# Altium project MB1355C.PrjPcb
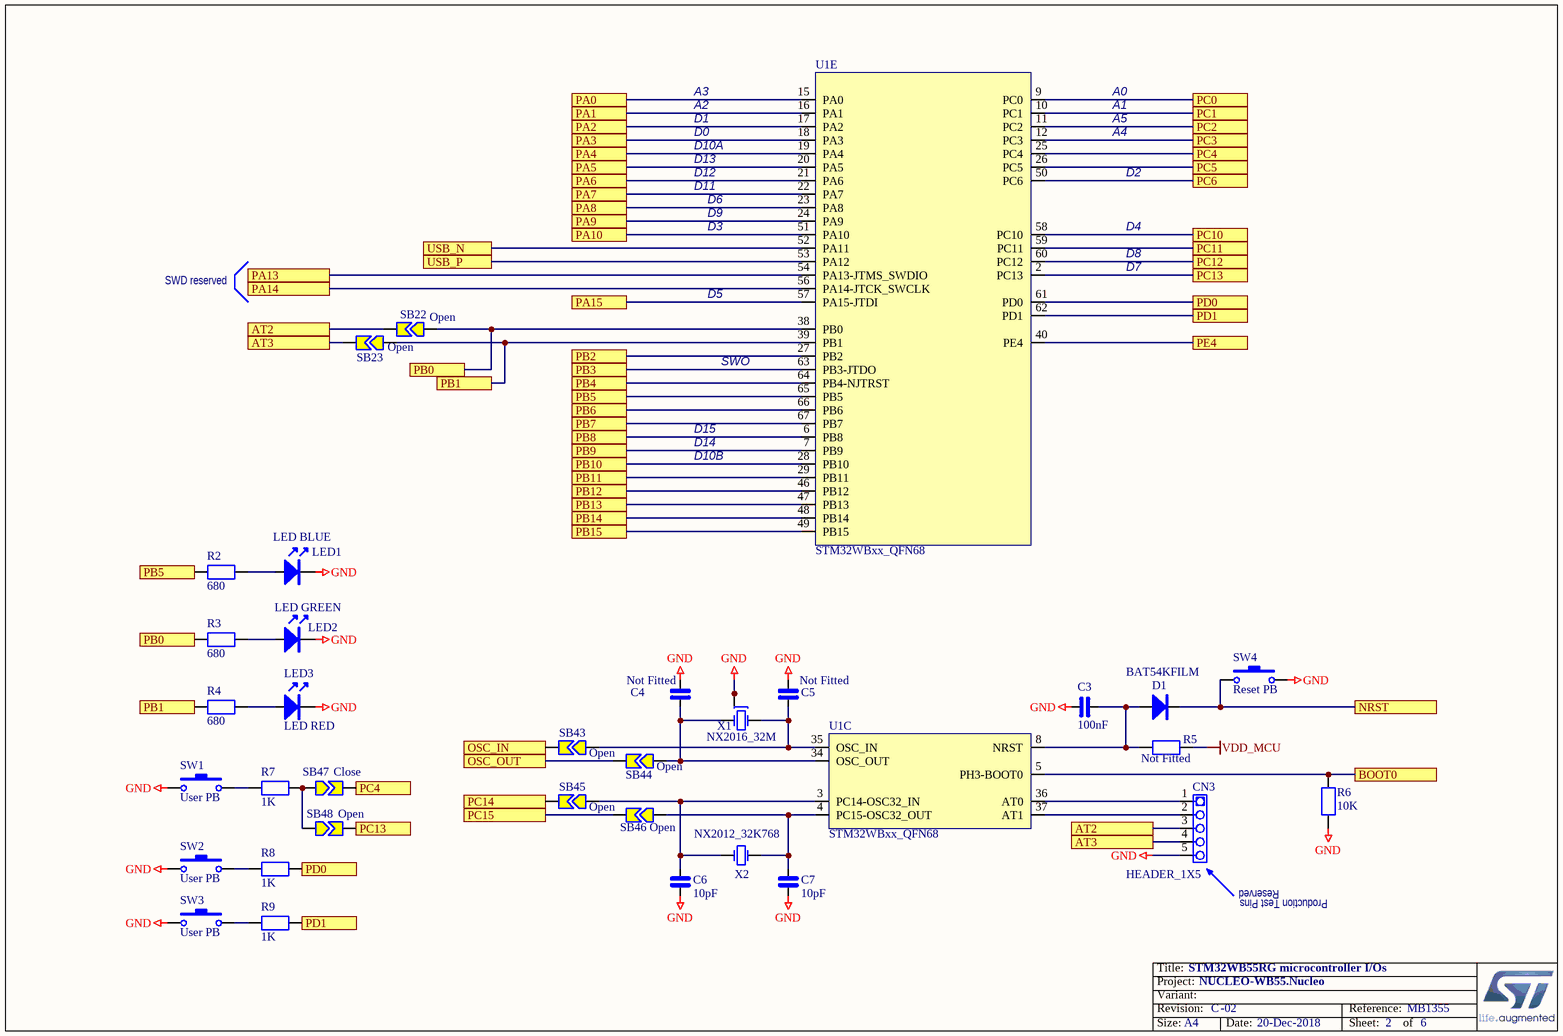
[diagram p0: MCU.SchDoc]
Board_Assembly_Revision: 02; Board_Document_Date: 20-Dec-2018; Board_Name: NUCLEO-WB55.Nucleo; Board_PCB_Revision: C; Board_Reference: MB1355
3 sheets, 148 parts. Net scope: flat (ports and power ports of the same name join across sheets).
Board file: Nucleo_Dory_QFN68.PcbDoc
Sheets:
  MCU.SchDoc
  Power_managment.SchDoc
  ST_LINK_V2-1.SCHDOC

## Sheet MCU.SchDoc: STM32WB55RG microcontroller I/Os
size A4; Author: Ph.A; SheetNumber: 2; SheetTotal: 6

### Parts
C3  100nF  [0402_CAP_NPOL]
C4  Fitted: Not Fitted  [0402_CAP_NPOL]  (hidden comment: TBD)
C5  Fitted: Not Fitted  [0402_CAP_NPOL]  (hidden comment: TBD)
C6  10pF  [0402_CAP_NPOL]
C7  10pF  [0402_CAP_NPOL]
CN3  HEADER_1X5  [Header NF 1x5x2.54 TH]
D1  BAT54KFILM  [SOD523]
LED1  LED BLUE  [0603_LED_Blue]
LED2  LED GREEN  [0603_LED_GREEN]
LED3  LED RED  [0603_LED_RED]
R2  680  [0402_RES]
R3  680  [0402_RES]
R4  680  [0402_RES]
R5  Fitted: Not Fitted  [0402_RES]  (hidden comment: 100K (not fitted))
R6  10K  [0402_RES]
R7  1K  [0402_RES]
R8  1K  [0402_RES]
R9  1K  [0402_RES]
SB22  Open  [SB-tiny]
SB23  Open  [SB-tiny]
SB43  Open  [SB-tiny]
SB44  Open  [SB-tiny]
SB45  Open  [SB-tiny]
SB46  Open  [SB-tiny]
SB47  Close  [SB-tiny]
SB48  Open  [SB-tiny]
SW1  User PB  [SW-PB SMD KMR2]
SW2  User PB  [SW-PB SMD KMR2]
SW3  User PB  [SW-PB SMD KMR2]
SW4  Reset PB  [SW-PB SMD KMR2]
U1  STM32WBxx_QFN68  [VFQFPN68_8x8x0.1_p0.4]  (parts C,E of 5)
X1  NX2016_32M  [NX2016_4P]
X2  NX2012_32K768  [NX2012_2P]

### Ports
AT2, AT3, BOOT0, NRST, OSC_IN, OSC_OUT, PA0, PA1, PA2, PA3, PA4, PA5, PA6, PA7, PA8, PA9, PA10, PA13, PA14, PA15, PB0, PB1, PB2, PB3, PB4, PB5, PB6, PB7, PB8, PB9, PB10, PB11, PB12, PB13, PB14, PB15, PC0, PC1, PC2, PC3, PC4, PC5, PC6, PC10, PC11, PC12, PC13, PC14, PC15, PD0, PD1, PE4, USB_N, USB_P

### Nets
GND: C3.1 C4.2 C5.2 C6.2 C7.2 CN3.5 LED1.K LED2.K LED3.K R6.2 SW1.1 SW2.1 SW3.1 SW4.2 X1.2 X1.4
VDD_MCU: R5.1
AT2: CN3.3 SB22.2 ; port AT2
AT3: CN3.4 SB23.2 ; port AT3
BOOT0: R6.1 U1.5(PH3-BOOT0) ; port BOOT0
NRST: D1.K SW4.1 ; port NRST
OSC_IN: SB43.2 ; port OSC_IN
OSC_OUT: SB44.2 ; port OSC_OUT
PA0: U1.15(PA0) ; port PA0
PA1: U1.16(PA1) ; port PA1
PA2: U1.17(PA2) ; port PA2
PA3: U1.18(PA3) ; port PA3
PA4: U1.19(PA4) ; port PA4
PA5: U1.20(PA5) ; port PA5
PA6: U1.21(PA6) ; port PA6
PA7: U1.22(PA7) ; port PA7
PA8: U1.23(PA8) ; port PA8
PA9: U1.24(PA9) ; port PA9
PA10: U1.51(PA10) ; port PA10
PA13: U1.54(PA13-JTMS_SWDIO) ; port PA13
PA14: U1.56(PA14-JTCK_SWCLK) ; port PA14
PA15: U1.57(PA15-JTDI) ; port PA15
PB0: R3.1 SB22.1 U1.38(PB0) ; port PB0
PB1: R4.1 SB23.1 U1.39(PB1) ; port PB1
PB2: U1.27(PB2) ; port PB2
PB3: U1.63(PB3-JTDO) ; port PB3
PB4: U1.64(PB4-NJTRST) ; port PB4
PB5: R2.1 U1.65(PB5) ; port PB5
PB6: U1.66(PB6) ; port PB6
PB7: U1.67(PB7) ; port PB7
PB8: U1.6(PB8) ; port PB8
PB9: U1.7(PB9) ; port PB9
PB10: U1.28(PB10) ; port PB10
PB11: U1.29(PB11) ; port PB11
PB12: U1.46(PB12) ; port PB12
PB13: U1.47(PB13) ; port PB13
PB14: U1.48(PB14) ; port PB14
PB15: U1.49(PB15) ; port PB15
PC0: U1.9(PC0) ; port PC0
PC1: U1.10(PC1) ; port PC1
PC2: U1.11(PC2) ; port PC2
PC3: U1.12(PC3) ; port PC3
PC4: SB47.2 U1.25(PC4) ; port PC4
PC5: U1.26(PC5) ; port PC5
PC6: U1.50(PC6) ; port PC6
PC10: U1.58(PC10) ; port PC10
PC11: U1.59(PC11) ; port PC11
PC12: U1.60(PC12) ; port PC12
PC13: SB48.2 U1.2(PC13) ; port PC13
PC14: SB45.2 ; port PC14
PC15: SB46.2 ; port PC15
PD0: R8.2 U1.61(PD0) ; port PD0
PD1: R9.2 U1.62(PD1) ; port PD1
PE4: U1.40(PE4) ; port PE4
USB_N: U1.52(PA11) ; port USB_N
USB_P: U1.53(PA12) ; port USB_P
NetC3_2: C3.2 D1.A R5.2 U1.8(NRST)
NetC4_1: C4.1 SB44.1 U1.34(OSC_OUT) X1.3(OSC2)
NetC5_1: C5.1 SB43.1 U1.35(OSC_IN) X1.1(OSC1)
NetC6_1: C6.1 SB45.1 U1.3(PC14-OSC32_IN) X2.1(OSC1)
NetC7_1: C7.1 SB46.1 U1.4(PC15-OSC32_OUT) X2.2(OSC2)
NetCN3_1: CN3.1 U1.36(AT0)
NetCN3_2: CN3.2 U1.37(AT1)
NetLED1_A: LED1.A R2.2
NetLED2_A: LED2.A R3.2
NetLED3_A: LED3.A R4.2
NetR7_1: R7.1 SW1.2
NetR7_2: R7.2 SB47.1 SB48.1
NetR8_1: R8.1 SW2.2
NetR9_1: R9.1 SW3.2

### Notes on the sheet
- A2
- A3
- A0
- A1
- D12
- D13
- D0
- D1
- D10A
- A4
- A5
- D2
- D11
- D9
- D3
- D6
- D4
- SWD reserved
- D5
- D7
- D8
- SWO
- D14
- D15
- D10B
- (near CN3) Reserved
- (near CN3) Production Test Pins
- Title:
- Project:
- Size:
- Revision:
- Variant:
- -
- Date:
- Reference:
- Sheet:
- of

### Library data of the parts
C3-C7 = CAP_NPOL: Capacitor_not polarized
D1 = BAT54K: Schottky Diode
LED1-LED3 = LED: Light-Emitting Diode; Part Number A: *
  LED1: Color: BLUE
R2-R9 = RES: Resistor
SB22 SB23 SB43-SB48 = Strap2: Solder Jumper; Solder: YES; Published: 24-Mar-1999; Revision: July-2002: Re-released for DXP Platform.; Publisher: Altium Limited
SW1-SW4 = SW-PB_1: Push-button SMD; Order code RS: 102-412
X1 = NX2016_32M: Crystal NDK 2.0x1.6mm  32 MHz; Manufacturer P/N: NX2016SA 32 MHz EXS00A-CS06654; Ref: NX2016SA 32MHz  EXS00A-CS06654  Référence interne NDK : X5087283; Manufacturer: NDK
X2 = NX2012_32K768: Crystal NDK 2.0x1.2mm  32.768 KHz; Manufacturer P/N: NX2012SA 32.768KHz  EXS00A-MU00389; Ref: NX2012SA 32.768KHz  EXS00A-MU00389  Référence interne NDK : X3037088; Manufacturer: NDK

## Sheet Power_managment.SchDoc: Power Management
size A4; Author: Ph.A; SheetNumber: 5; SheetTotal: 6
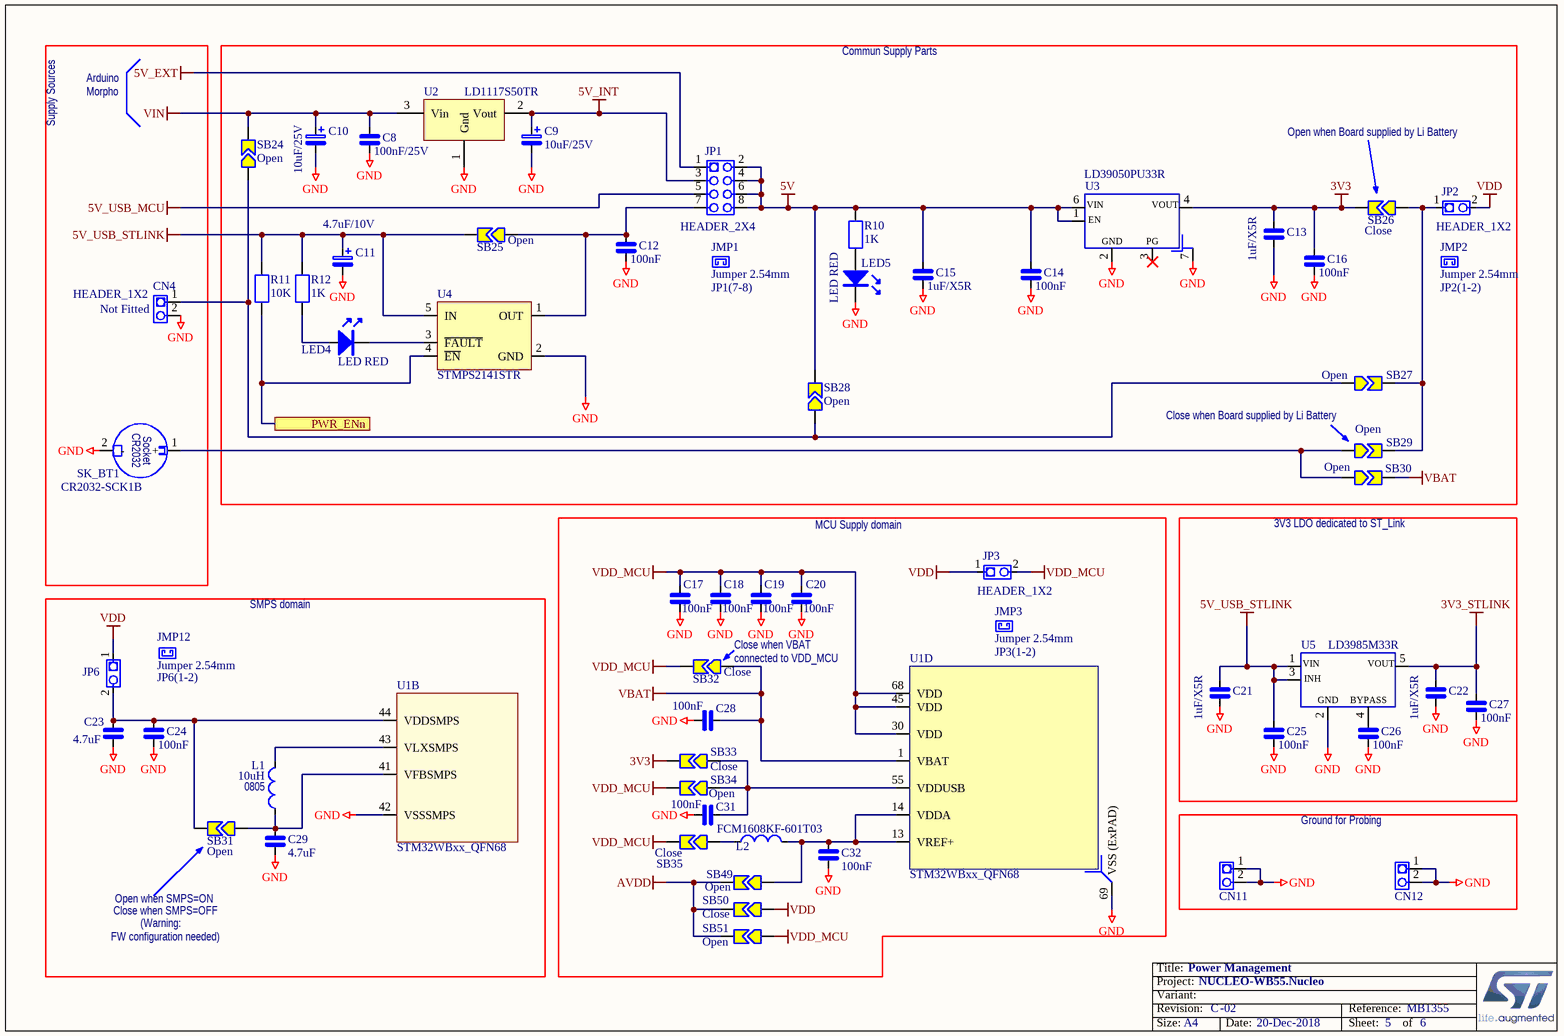
[diagram p1: Power_managment.SchDoc]

### Parts
C8  100nF/25V  [0402_CAP_NPOL]
C9  10uF/25V  [1210_CAP_POL]
C10  10uF/25V  [1210_CAP_POL]
C11  4.7uF/10V  [1210_CAP_POL]
C12  100nF  [0402_CAP_NPOL]
C13  1uF/X5R  [0603_CAP_NPOL]
C14  100nF  [0402_CAP_NPOL]
C15  1uF/X5R  [0603_CAP_NPOL]
C16  100nF  [0402_CAP_NPOL]
C17  100nF  [0402_CAP_NPOL]
C18  100nF  [0402_CAP_NPOL]
C19  100nF  [0402_CAP_NPOL]
C20  100nF  [0402_CAP_NPOL]
C21  1uF/X5R  [0603_CAP_NPOL]
C22  1uF/X5R  [0603_CAP_NPOL]
C23  4.7uF  [0402_CAP_NPOL]
C24  100nF  [0402_CAP_NPOL]
C25  100nF  [0402_CAP_NPOL]
C26  100nF  [0402_CAP_NPOL]
C27  100nF  [0402_CAP_NPOL]
C28  100nF  [0402_CAP_NPOL]
C29  4.7uF  [0402_CAP_NPOL]
C31  100nF  [0402_CAP_NPOL]
C32  100nF  [0402_CAP_NPOL]
CN4  HEADER_1X2  Fitted: Not Fitted  [Header NF 1x2x2.54 TH]
CN11  HEADER_1X2  [Header M 1x2x2.54 TH V]  (value not drawn)
CN12  HEADER_1X2  [Header M 1x2x2.54 TH V]  (value not drawn)
JMP1  Jumper 2.54mm  Default: JP1(7-8)  [Jumper 2.54mm BLACK]
JMP2  Jumper 2.54mm  Default: JP2(1-2)  [Jumper 2.54mm BLACK]
JMP3  Jumper 2.54mm  default: JP3(1-2)  [Jumper 2.54mm BLACK]
JMP12  Jumper 2.54mm  default: JP6(1-2)  [Jumper 2.54mm BLACK]
JP1  HEADER_2X4  [Header M 2x4x2.54 TH V]
JP2  HEADER_1X2  [Header M 1x2x2.54 TH V]
JP3  HEADER_1X2  [Header M 1x2x2.54 TH V]
JP6  HEADER_1X2  [Header M 1x2x2.54 TH V]  (value not drawn)
L1  10uH  [0805_COIL]
L2  FCM1608KF-601T03  [0603_COIL]
LED4  LED RED  [0603_LED_RED]
LED5  LED RED  [0603_LED_RED]
R10  1K  [0402_RES]
R11  10K  [0402_RES]
R12  1K  [0402_RES]
SB24  Open  [SB-tiny]
SB25  Open  [SB-tiny]
SB26  Close  [SB-tiny]
SB27  Open  [SB-tiny]
SB28  Open  [SB-tiny]
SB29  Open  [SB-tiny]
SB30  Open  [SB-tiny]
SB31  Open  [SB-tiny]
SB32  Close  [SB-tiny]
SB33  Close  [SB-tiny]
SB34  Open  [SB-tiny]
SB35  Close  [SB-tiny]
SB49  Open  [SB-tiny]
SB50  Close  [SB-tiny]
SB51  Open  [SB-tiny]
SK_BT1  CR2032-SCK1B  [CR2032-SCK1]
U1  STM32WBxx_QFN68  [VFQFPN68_8x8x0.1_p0.4]  (parts B,D of 5)
U2  LD1117S50TR  [SOT223_SC73_A]
U3  LD39050PU33R  [DFN6 3x3mm]
U4  STMPS2141STR  [SOT23-5]
U5  LD3985M33R  [SOT23-5]

### Blocks framed on the sheet
3V3 LDO dedicated to ST_Link: C21 C22 C25-C27 U5
Ground for Probing: CN11 CN12

### Ports
PWR_ENn

### Nets
3V3: C13.1 C16.1 SB26.2 SB33.2 U3.4(VOUT)
3V3_STLINK: C22.1 C27.1 U5.5(VOUT)
5V: C14.1 C15.1 JP1.2 JP1.4 JP1.6 JP1.8 R10.1 SB28.2 U3.1(EN) U3.6(VIN)
5V_EXT: JP1.1
5V_INT: C9.1 JP1.3 U2.2(Vout)
5V_USB_MCU: JP1.5
5V_USB_STLINK: C11.1 C21.1 C25.1 R11.1 R12.1 SB25.2 U4.5(IN) U5.1(VIN) U5.3(CE)
AVDD: SB49.2 SB50.2 SB51.2
GND: C8.2 C9.2 C10.2 C11.2 C12.2 C13.2 C14.2 C15.2 C16.2 C17.2 C18.2 C19.2 C20.2 C21.2 C22.2 C23.2 C24.2 C25.2 C26.2 C27.2 C28.2 C29.2 C31.2 C32.2 CN4.2 CN11.1 CN11.2 CN12.1 CN12.2 LED5.K SK_BT1.2(-) U1.42(VSSSMPS) U1.69(VSS_(ExPAD)) U2.1(Gnd) U3.2(VSS) U3.7 U4.2(GND) U5.2(VSS)
VBAT: C28.1 SB30.2 SB32.1 U1.1(VBAT)
VDD: JP2.2 JP3.1 JP6.1 SB50.1
VDD_MCU: C17.1 C18.1 C19.1 C20.1 JP3.2 SB32.2 SB34.2 SB35.2 SB51.1 U1.30(VDD) U1.45(VDD) U1.68(VDD)
VIN: C8.1 C10.1 SB24.2 U2.3(Vin)
PWR_ENn: R11.2 U4.4(~{EN}) ; port PWR_ENn
NetC12_1: C12.1 JP1.7 SB25.1 U4.1(OUT)
NetC23_1: C23.1 C24.1 JP6.2 SB31.2 U1.44(VDDSMPS)
NetC26_1: C26.1 U5.4(BYPASS)
NetC29_1: C29.1 L1.1 SB31.1 U1.41(VFBSMPS)
NetC31_1: C31.1 SB33.1 SB34.1 U1.55(VDDUSB)
NetC32_1: C32.1 L2.2 SB49.1 U1.13(VREF+) U1.14(VDDA)
NetCN4_1: CN4.1 SB24.1 SB27.1 SB28.1
NetJP2_1: JP2.1 SB26.1 SB27.2 SB29.2
NetL1_2: L1.2 U1.43(VLXSMPS)
NetL2_1: L2.1 SB35.1
NetLED4_A: LED4.A R12.2
NetLED4_K: LED4.K U4.3(~{FAULT})
NetLED5_A: LED5.A R10.2
NetSB29_1: SB29.1 SB30.1 SK_BT1.1(+)

Not connected (* = marked no-connect by the designer): U3 3(PG)*

### Notes on the sheet
- Arduino
- Morpho
- Commun Supply Parts
- Supply Sources
- Open when Board supplied by Li Battery
- Close when Board supplied by Li Battery
- MCU Supply domain
- SMPS domain
- (near SB32) Close when VBAT
- (near SB32) connected to VDD_MCU
- (near L1) 0805
- Close when SMPS=OFF
- Open when SMPS=ON
- FW configuration needed)
- (Warning:
- Title:
- Project:
- Size:
- Revision:
- Variant:
- A4
- -
- Date:
- Reference:
- Sheet:
- of
- (in symbol CR2032-SCK1B) CR2032; Socket
- (in symbol LD3985M33R) INH; GND
- (in symbol LD39050PU33R) GND

### Library data of the parts
C8 C12-C29 C31 C32 = CAP_NPOL: Capacitor_not polarized
C9-C11 = CAP_POL: Condensateur_polarise
JP2 JP3 JP6 = HEADER_1X2_L
L1 = IND_74479777310A: Coil Wurtz 10uH ref: 74479777310A
L2 = IND_FCM1608KF-601T03
LED4 LED5 = LED: Light-Emitting Diode; Part Number A: *
R10-R12 = RES: Resistor
SB24-SB35 SB49-SB51 = Strap2: Solder Jumper; Solder: YES; Published: 24-Mar-1999; Revision: July-2002: Re-released for DXP Platform.; Publisher: Altium Limited
U2 = LD1117S50TR: IC REG LDO 5V 0.8A SOT223; Manuf_1: STM; ECCN_US/EU: EAR99/NEC; Ref St: 9176133; Fitted: YES; Manuf_Part_1: LD1117S50TR; Distrib: STM; Ordered_By: STM; Order_code: LD1117S50TR; Value: LD1117S50TR
U3 = LD39050PU33R: 3.3V voltage regulator 500mA
U4 = STMPS2141STR: Enhanced single channel power switches; Manuf_1: STM; Provided: ST; ECCN_US/EU: EAR99/NEC; Ref St: 9159003; Order: STMPS2141STR; Manuf_Part_1: STMPS2141STR; Distrib: ST; Ordered by: ST
U5 = LD3985M33R: 3.3V low drop voltage regulator; Manufacturer: STMicroelectronics; Isortie max: 550mA; V entrée max: 6V; Manufacturer P/N: LD3985M33R; Order code Farnell: *; V sortie Typ. V: 3.3V; Temperature Max: +125°C; Type: Fixed; Temperature Min: -40°C

## Sheet ST_LINK_V2-1.SCHDOC: ST-Link/V2-1
size A4; Author: Ph.A; SheetNumber: 6; SheetTotal: 6
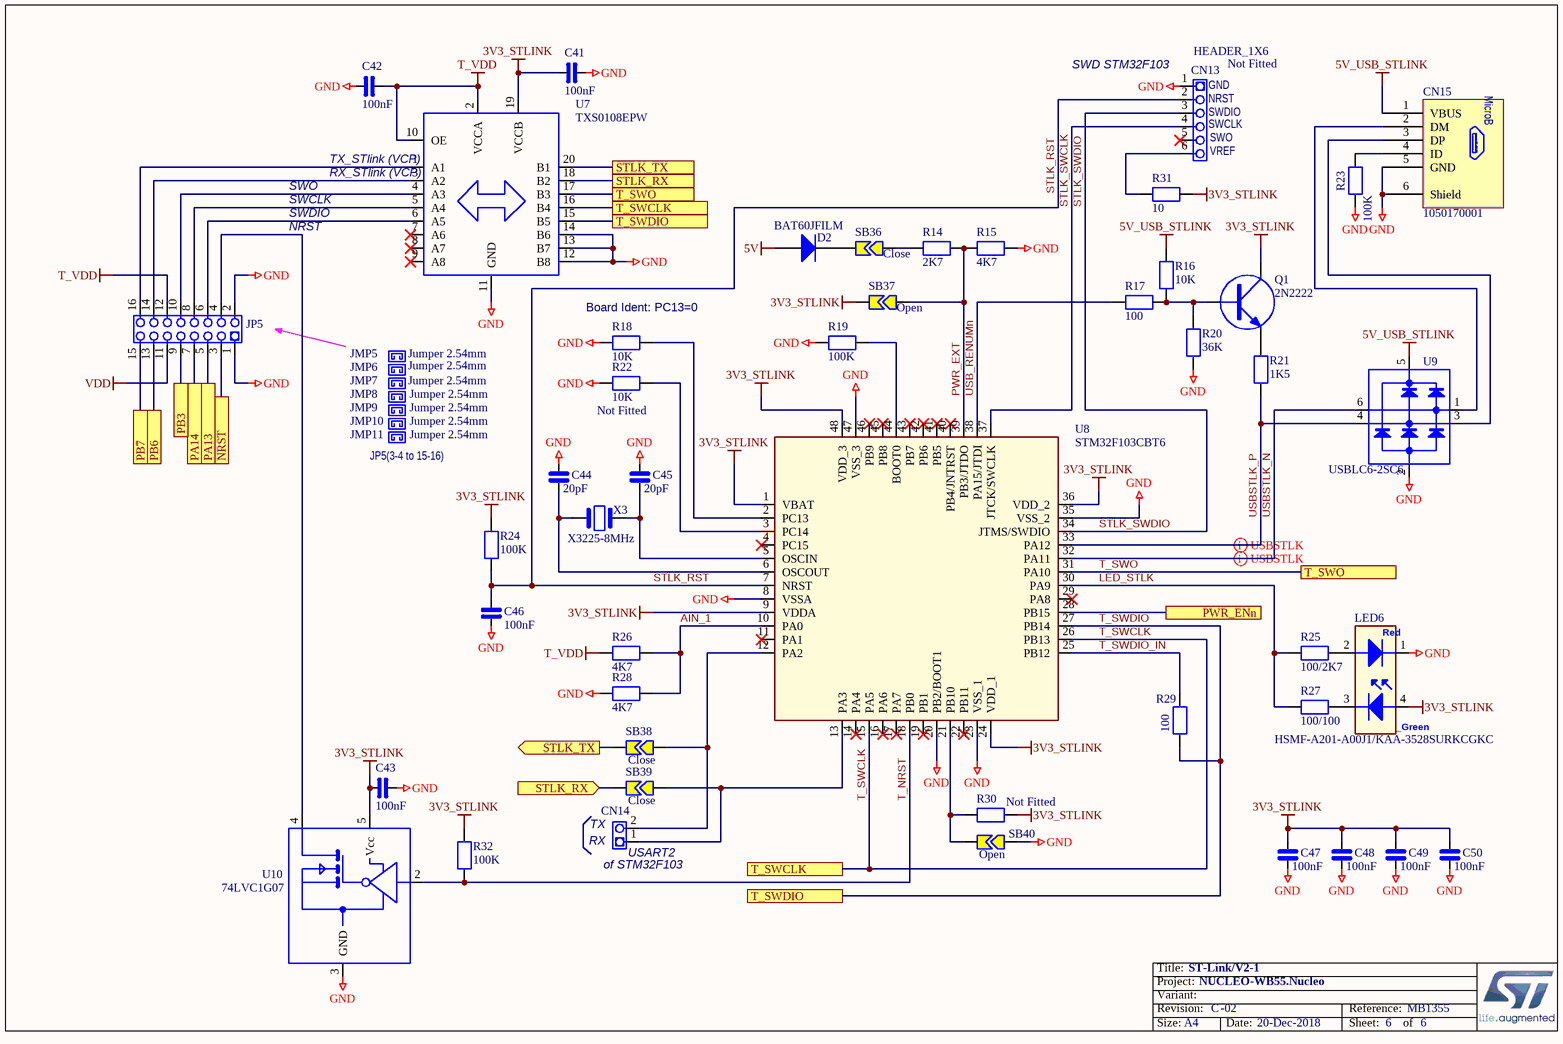
[diagram p2: ST_LINK_V2-1.SCHDOC]

### Parts
C41  100nF  [0402_CAP_NPOL]
C42  100nF  [0402_CAP_NPOL]
C43  100nF  [0402_CAP_NPOL]
C44  20pF  [0402_CAP_NPOL]
C45  20pF  [0402_CAP_NPOL]
C46  100nF  [0402_CAP_NPOL]
C47  100nF  [0402_CAP_NPOL]
C48  100nF  [0402_CAP_NPOL]
C49  100nF  [0402_CAP_NPOL]
C50  100nF  [0402_CAP_NPOL]
CN13  HEADER_1X6  Fitted: Not Fitted  [Header NF 1x6x2.54 TH]
CN14  HEADER_1X2  [Header NF 1x2x2.54 TH]  (value not drawn)
CN15  1050170001  [USBMICROB_MOLEX_105017-0001_H2P90]
D2  BAT60JFILM  [SOD-323]
JMP5  Jumper 2.54mm  [Jumper 2.54mm BLACK]
JMP6  Jumper 2.54mm  [Jumper 2.54mm BLACK]
JMP7  Jumper 2.54mm  [Jumper 2.54mm BLACK]
JMP8  Jumper 2.54mm  [Jumper 2.54mm BLACK]
JMP9  Jumper 2.54mm  [Jumper 2.54mm BLACK]
JMP10  Jumper 2.54mm  [Jumper 2.54mm BLACK]
JMP11  Jumper 2.54mm  [Jumper 2.54mm BLACK]
JP5  HEADER_2X8  [Header M 2x8x2.54 TH V]  (value not drawn)
LED6  HSMF-A201-A00J1/KAA-3528SURKCGKC  [HSMF-A201]
Q1  2N2222  [SOT23-3]
R14  2K7  [0402_RES]
R15  4K7  [0402_RES]
R16  10K  [0402_RES]
R17  100  [0402_RES]
R18  10K  [0402_RES]
R19  100K  [0402_RES]
R20  36K  [0402_RES]
R21  1K5  [0402_RES]
R22  10K  Fitted: Not Fitted  [0402_RES]
R23  100K  [0402_RES]
R24  100K  [0402_RES]
R25  100/2K7  [0402_RES]
R26  4K7  [0402_RES]
R27  100/100  [0402_RES]
R28  4K7  [0402_RES]
R29  100  [0402_RES]
R30  Fitted: Not Fitted  [0402_RES]
R31  10  [0402_RES]
R32  100K  [0402_RES]
SB36  Close  [SB-tiny]
SB37  Open  [SB-tiny]
SB38  Close  [SB-tiny]
SB39  Close  [SB-tiny]
SB40  Open  [SB-tiny]
U7  TXS0108EPW  [TSSOP20]
U8  STM32F103CBT6  [LQFP48_7X7_P050]
U9  USBLC6-2SC6  [SOT23-6]
U10  74LVC1G07  [SOT353-1]
X3  X3225-8MHz  [X3225]

### Ports
NRST, PA13, PA14, PB3, PB6, PB7, PWR_ENn, STLK_RX, STLK_RX (in), STLK_TX, STLK_TX (out), T_SWCLK, T_SWDIO, T_SWO

### Nets
3V3_STLINK: C41.1 C43.1 C47.1 C48.1 C49.1 C50.1 LED6.4 Q1.3(C) R24.2 R30.1 R31.2 R32.2 SB37.1 U7.19(VCCB) U8.1(VBAT) U8.9(VDDA) U8.24(VDD_1) U8.36(VDD_2) U8.48(VDD_3) U10.5(Vcc)
5V: D2.1(A)
5V_USB_STLINK: CN15.1(VBUS) R16.2 U9.5
GND: C41.2 C42.1 C43.2 C44.1 C45.1 C46.1 C47.2 C48.2 C49.2 C50.2 CN13.1 CN15.5(GND) CN15.6(Shield) JP5.1 JP5.2 LED6.1 R15.2 R18.2 R19.1 R20.1 R22.2 R23.1 R28.2 SB40.2 U7.11(GND) U7.12(B8) U7.13(B7) U7.14(B6) U8.8(VSSA) U8.20(PB2/BOOT1) U8.23(VSS_1) U8.35(VSS_2) U8.47(VSS_3) U9.2 U10.3(GND)
T_VDD: C42.2 JP5.12 R26.2 U7.2(VCCA) U7.10(OE)
VDD: JP5.11
AIN_1: R26.1 R28.1 U8.10(PA0)
LED_STLK: R25.2 R27.2 U8.30(PA9)
NRST: JP5.3 ; port NRST
PA13: JP5.5 ; port PA13
PA14: JP5.7 ; port PA14
PB3: JP5.9 ; port PB3
PB6: JP5.13 ; port PB6
PB7: JP5.15 ; port PB7
PWR_ENn: U8.28(PB15) ; port PWR_ENn
PWR_EXT: R14.2 R15.1 SB37.2 U8.39(PB3/JTDO)
STLK_RST: C46.2 CN13.2 R24.1 U8.7(NRST)
STLK_RX: SB39.1 U7.18(B2) ; port STLK_RX
STLK_SWCLK: CN13.4 U8.37(JTCK/SWCLK)
STLK_SWDIO: CN13.3 U8.34(JTMS/SWDIO)
STLK_TX: SB38.1 U7.20(B1) ; port STLK_TX
T_NRST: R32.1 U8.18(PB0) U10.2(A)
T_SWCLK: U7.16(B4) U8.15(PA5) U8.26(PB13) ; port T_SWCLK
T_SWDIO: R29.1 U7.15(B5) U8.27(PB14) ; port T_SWDIO
T_SWDIO_IN: R29.2 U8.25(PB12)
T_SWO: U7.17(B3) U8.31(PA10) ; port T_SWO
USB_RENUMn: R17.2 U8.38(PA15/JTDI)
USBSTLK_N: U8.32(PA11) U9.6
USBSTLK_P: R21.1 U8.33(PA12) U9.4
NetC44_2: C44.2 U8.6(OSCOUT) X3.1
NetC45_2: C45.2 U8.5(OSCIN) X3.3
NetCN13_6: CN13.6 R31.1
NetCN14_1: CN14.1 SB39.2 U8.13(PA3)
NetCN14_2: CN14.2 SB38.2 U8.12(PA2)
NetCN15_2: CN15.2(DM) U9.1
NetCN15_3: CN15.3(DP) U9.3
NetCN15_4: CN15.4(ID) R23.2
NetD2_2: D2.2(K) SB36.1
NetJP5_4: JP5.4 U10.4(Y)
NetJP5_6: JP5.6 U7.6(A5)
NetJP5_8: JP5.8 U7.5(A4)
NetJP5_10: JP5.10 U7.4(A3)
NetJP5_14: JP5.14 U7.3(A2)
NetJP5_16: JP5.16 U7.1(A1)
NetLED6_2: LED6.2 R25.1
NetLED6_3: LED6.3 R27.1
NetQ1_1: Q1.1(B) R16.1 R17.1 R20.2
NetQ1_2: Q1.2(E) R21.2
NetR14_1: R14.1 SB36.2
NetR18_1: R18.1 U8.2(PC13)
NetR19_2: R19.2 U8.44(BOOT0)
NetR22_1: R22.1 U8.3(PC14)
NetR30_2: R30.2 SB40.1 U8.21(PB10)

Not connected (* = marked no-connect by the designer): CN13 5*; U7 7(A6)* 8(A7)* 9(A8)*; U8 4(PC15)* 11(PA1)* 14(PA4)* 16(PA6)* 17(PA7)* 19(PB1)* 22(PB11)* 29(PA8)* 40(PB4/JNTRST)* 41(PB5)* 42(PB6)* 43(PB7)* 45(PB8)* 46(PB9)*

### Layout directives
differential pair; net class DIFF90: USBSTLK_N, USBSTLK_P

### Notes on the sheet
- (near CN13) SWD STM32F103
- (near CN13) SWDIO
- (near CN13) NRST
- (near CN13) GND
- TX_STlink (VCP)
- RX_STlink (VCP)
- (near CN13) SWCLK
- (near CN13) SWO
- (near CN13) VREF
- SWO
- SWCLK
- SWDIO
- NRST
- Board Ident: PC13=0
- (near JMP11) JP5(3-4 to 15-16)
- (near CN14) RX
- TX
- (near CN14) USART2
- (near CN14) of STM32F103
- Title:
- Project:
- Size:
- Revision:
- Variant:
- A4
- -
- Date:
- Reference:
- Sheet:
- of
- (in symbol 1050170001) MicroB
- (in symbol LD_BICOLOR_CMS) Red; _Green

### Library data of the parts
C41-C50 = CAP_NPOL: Capacitor_not polarized
CN15 = 1050170001: USB-MICRO-B, 1050170001, SMT, MOLEX; Fitted: YES; Ordered_By: Subcon; ECCN_US/EU: n/a; Manuf_1: MOLEX; Manuf_Part_1: 1050170001; Distrib: DIGIKEY; Value: 1050170001; Order_Code: *
D2 = Diode: Default Diode; Code - JEDEC: DO-214-AB; Ordered by: STM; ECCN_US/EU: EAR99/NEC; Published: 8-Jun-2000; Revision: July-2002: Re-released for DXP Platform.; Publisher: Altium Limited
LED6 = LD_BICOLOR_CMS: Bicolor Led; Manuf_1: Avago Technologies; Manuf_2: kingbright; Manuf_Part_1: HSMF-A201-A00J1; Manuf_Part_2: KAA-3528SURKCGKC
Q1 = 2N2222: 2N2222_SOT23
R14-R32 = RES: Resistor
SB36-SB40 = Strap2: Solder Jumper; Solder: YES; Published: 24-Mar-1999; Revision: July-2002: Re-released for DXP Platform.; Publisher: Altium Limited
U7 = TXS0108EPW: TXS0108E Bi-directional Level Shifter TSSOP20
U8 = STM32F103CBT6: Medium-density performance line ARM-based 32-bit MCU with 128KB Flash; Manuf_1: STM; ECCN_US/EU: 3A991A2/NEC; Fitted: YES; Manuf_Part_1: STM32F103CBT6; Distrib: STM; Order_Code: STM32F103CBT6; Ordered_By: STM; Value: STM32F103CBT6
U9 = USBLC6-2
X3 = X3225: Crystal 8MHz

## Nets that join several sheets
3V3_STLINK: Power_managment (C22.1 C27.1 U5.5), ST_LINK_V2-1 (20 pins)
5V: Power_managment (10 pins), ST_LINK_V2-1 (D2.1)
5V_USB_STLINK: Power_managment (9 pins), ST_LINK_V2-1 (CN15.1 R16.2 U9.5)
GND: MCU (16 pins), Power_managment (38 pins), ST_LINK_V2-1 (35 pins)
VDD: Power_managment (JP2.2 JP3.1 JP6.1 SB50.1), ST_LINK_V2-1 (JP5.11)
VDD_MCU: MCU (R5.1), Power_managment (12 pins)
NRST: MCU (D1.K SW4.1), ST_LINK_V2-1 (JP5.3)
PA13: MCU (U1.54), ST_LINK_V2-1 (JP5.5)
PA14: MCU (U1.56), ST_LINK_V2-1 (JP5.7)
PB3: MCU (U1.63), ST_LINK_V2-1 (JP5.9)
PB6: MCU (U1.66), ST_LINK_V2-1 (JP5.13)
PB7: MCU (U1.67), ST_LINK_V2-1 (JP5.15)
PWR_ENn: Power_managment (R11.2 U4.4), ST_LINK_V2-1 (U8.28)